# Altium schematic sheet MCU_STM32.SchDoc
size A; SheetNumber: 2; SheetTotal: 11
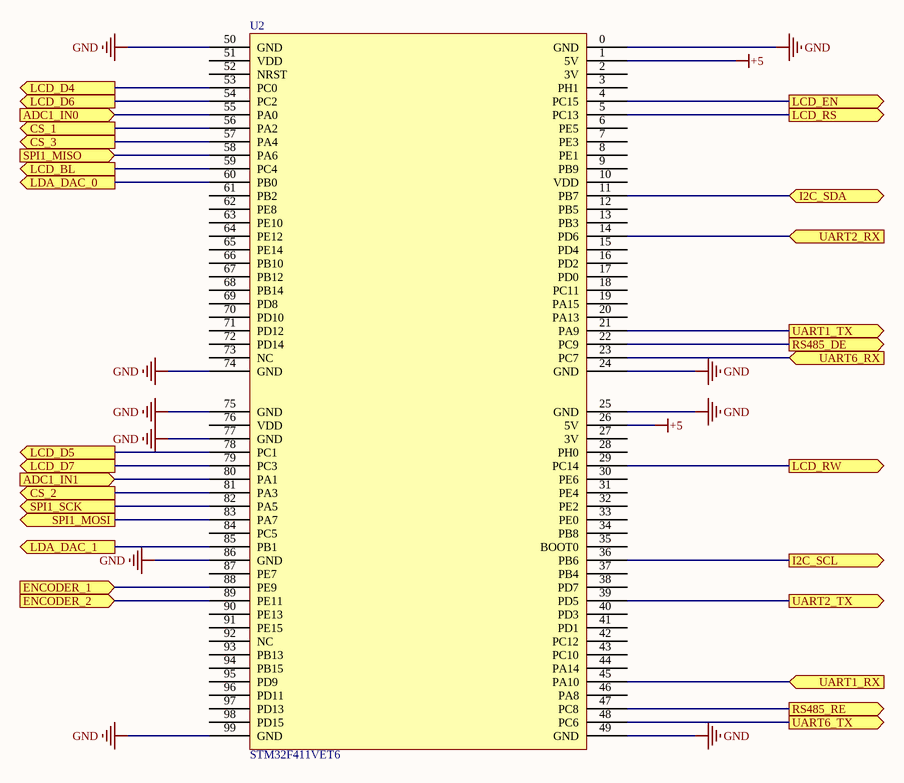
[diagram p0: MCU_STM32.SchDoc]

## Parts
U2  STM32F411VET6  [STM32F4]

## Ports
ADC1_IN0 (in), ADC1_IN1 (in), CS_1 (out), CS_2 (out), CS_3 (out), ENCODER_1 (in), ENCODER_2 (in), I2C_SCL (out), I2C_SDA (bidir), LCD_BL (out), LCD_D4 (out), LCD_D5 (out), LCD_D6 (out), LCD_D7 (out), LCD_EN (out), LCD_RS (out), LCD_RW (out), LDA_DAC_0 (out), LDA_DAC_1 (out), RS485_DE (out), RS485_RE (out), SPI1_MISO (in), SPI1_MOSI (out), SPI1_SCK (out), UART1_RX (in), UART1_TX (out), UART2_RX (in), UART2_TX (out), UART6_RX (in), UART6_TX (out)

## Nets
+5: U2.1(5V) U2.26(5V)
GND: U2.0(GND) U2.24(GND) U2.25(GND) U2.49(GND) U2.50(GND) U2.74(GND) U2.75(GND) U2.77(GND) U2.86(GND) U2.99(GND)
ADC1_IN0: U2.55(PA0) ; port ADC1_IN0
ADC1_IN1: U2.80(PA1) ; port ADC1_IN1
CS_1: U2.56(PA2) ; port CS_1
CS_2: U2.81(PA3) ; port CS_2
CS_3: U2.57(PA4) ; port CS_3
ENCODER_1: U2.88(PE9) ; port ENCODER_1
ENCODER_2: U2.89(PE11) ; port ENCODER_2
I2C_SCL: U2.36(PB6) ; port I2C_SCL
I2C_SDA: U2.11(PB7) ; port I2C_SDA
LCD_BL: U2.59(PC4) ; port LCD_BL
LCD_D4: U2.53(PC0) ; port LCD_D4
LCD_D5: U2.78(PC1) ; port LCD_D5
LCD_D6: U2.54(PC2) ; port LCD_D6
LCD_D7: U2.79(PC3) ; port LCD_D7
LCD_EN: U2.4(PC15) ; port LCD_EN
LCD_RS: U2.5(PC13) ; port LCD_RS
LCD_RW: U2.29(PC14) ; port LCD_RW
LDA_DAC_0: U2.60(PB0) ; port LDA_DAC_0
LDA_DAC_1: U2.85(PB1) ; port LDA_DAC_1
RS485_DE: U2.22(PC9) ; port RS485_DE
RS485_RE: U2.47(PC8) ; port RS485_RE
SPI1_MISO: U2.58(PA6) ; port SPI1_MISO
SPI1_MOSI: U2.83(PA7) ; port SPI1_MOSI
SPI1_SCK: U2.82(PA5) ; port SPI1_SCK
UART1_RX: U2.45(PA10) ; port UART1_RX
UART1_TX: U2.21(PA9) ; port UART1_TX
UART2_RX: U2.14(PD6) ; port UART2_RX
UART2_TX: U2.39(PD5) ; port UART2_TX
UART6_RX: U2.23(PC7) ; port UART6_RX
UART6_TX: U2.48(PC6) ; port UART6_TX

Not connected (* = marked no-connect by the designer): U2 2(3V) 3(PH1) 6(PE5) 7(PE3) 8(PE1) 9(PB9) 10(VDD) 12(PB5) 13(PB3) 15(PD4) 16(PD2) 17(PD0) 18(PC11) 19(PA15) 20(PA13) 27(3V) 28(PH0) 30(PE6) 31(PE4) 32(PE2) 33(PE0) 34(PB8) 35(BOOT0) 37(PB4) 38(PD7) 40(PD3) 41(PD1) 42(PC12) 43(PC10) 44(PA14) 46(PA8) 51(VDD) 52(NRST) 61(PB2) 62(PE8) 63(PE10) 64(PE12) 65(PE14) 66(PB10) 67(PB12) 68(PB14) 69(PD8) 70(PD10) 71(PD12) 72(PD14) 73(NC) 76(VDD) 84(PC5) 87(PE7) 90(PE13) 91(PE15) 92(NC) 93(PB13) 94(PB15) 95(PD9) 96(PD11) 97(PD13) 98(PD15)